# EAGLE design driver (EAGLE 6.5.0)
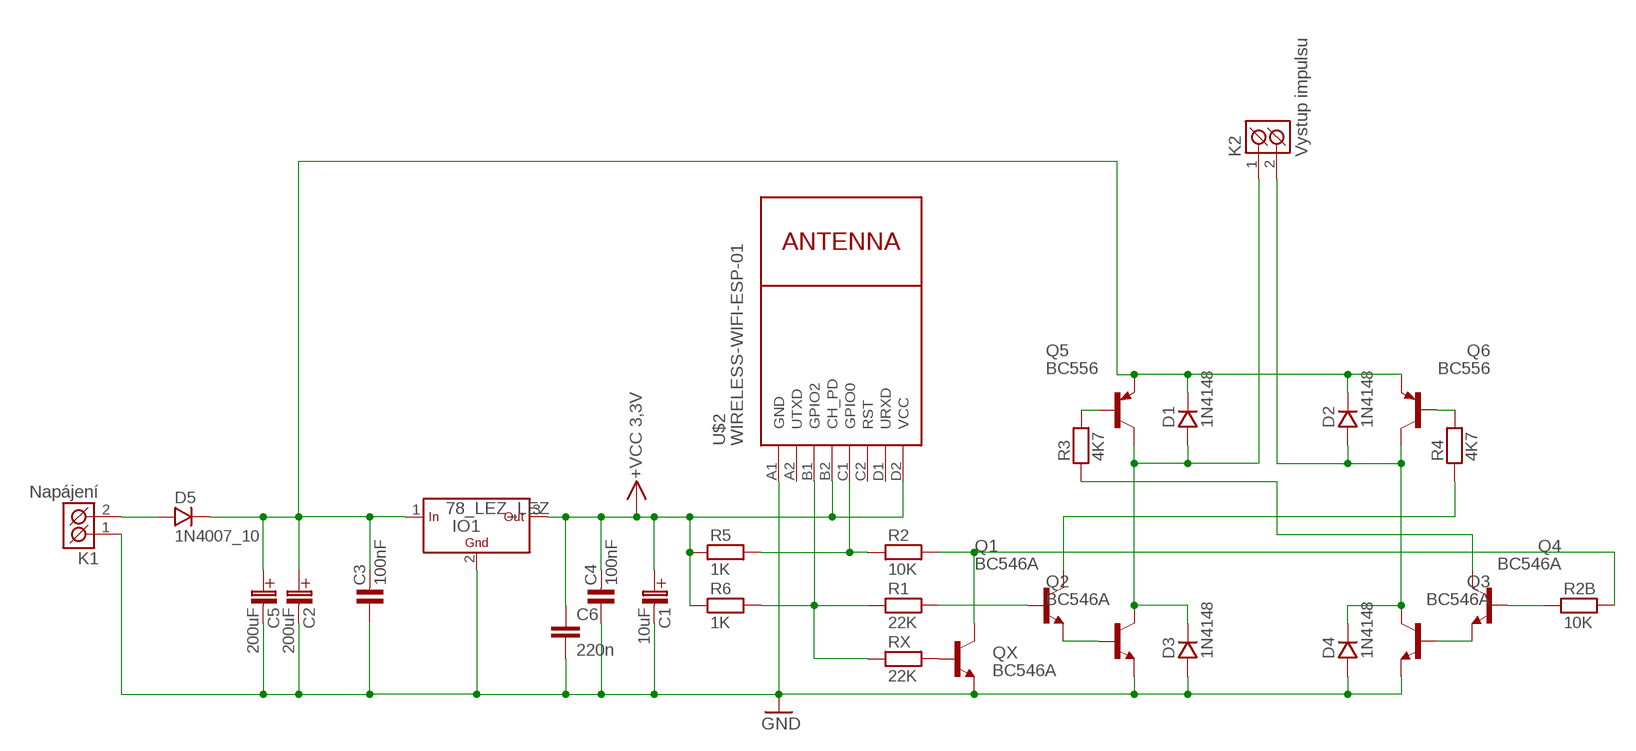
[diagram p0: schematic, sheet 1]

## Parts
C1  10uF  C-ELEKTROLYT_2,5  [C-EL_2,5]
C2  200uF  C-ELEKTROLYT_5  [C-EL_5]
C3  100nF  C-KERAMIK_5  [C-5]
C4  100nF  C-KERAMIK_5  [C-5]
C5  200uF  C-ELEKTROLYT_5  [C-EL_5]
C6  220n  C-EUC1206  [C1206]
D1  1N4148  1N4148_7,5  [DO35]
D2  1N4148  1N4148_7,5  [DO35]
D3  1N4148  1N4148_7,5  [DO35]
D4  1N4148  1N4148_7,5  [DO35]
D5  1N4007_10  [DO41]
IO1  78_LEZ_LEZ  [TO-220]
K1  Napájení  CZM_5/2  [CZM_5/2]
K2  Vystup impulsu  CZM_5/2  [CZM_5/2]
Q1  BC546A  [TO92-EBC]
Q2  BC546A  [TO92-EBC]
Q3  BC546A  [TO92-EBC]
Q4  BC546A  [TO92-EBC]
Q5  BC556  [TO92-EBC]
Q6  BC556  [TO92-EBC]
QX  BC546A  [TO92-EBC]
R1  22K  R_10  [R-10]
R2  10K  R_10  [R-10]
R2B  10K  R_10  [R-10]
R3  4K7  R_10  [R-10]
R4  4K7  R_10  [R-10]
R5  1K  R_10  [R-10]
R6  1K  R_10  [R-10]
RX  22K  R_10  [R-10]
U$2  WIRELESS-WIFI-ESP-01  [WIRELESS-WIFI-ESP-01]

## Nets
GND: C1.C-(C_EL-) C2.C-(C_EL-) C3.1 C4.1 C5.C-(C_EL-) C6.2 D3.A D4.A IO1.2(GND) K1.1(K1) Q2.E Q3.E QX.E U$2.A1(GND)
N$1: D2.A D4.K K2.2(K2) Q3.C Q6.C
N$2: D1.A D3.K K2.1(K1) Q2.C Q5.C
N$3: C2.C+(C_EL+) C3.2 C5.C+(C_EL+) D1.K D2.K D5.K IO1.1(IN) Q5.E Q6.E
N$4: Q5.B R3.2
N$5: Q6.B R4.2
N$6: Q4.C R3.1
N$7: Q1.C R4.1
N$8: Q4.B R2B.1
N$9: Q3.B Q4.E
N$10: Q1.E Q2.B
N$11: D5.A K1.2(K2)
N$12: Q1.B R1.2
N$13: R1.1 R6.2 RX.1 U$2.B1(GPIO2)
N$14: QX.C R2.2 R2B.2
N$15: R2.1 R5.2 U$2.C1(GPIO0)
N$16: QX.B RX.2
VCC: C1.C+(C_EL+) C4.2 C6.1 IO1.3(OUT) R5.1 R6.1 U$2.B2(CH_PD) U$2.D2(VCC) ; supply symbol labelled +VCC 3,3V
Unconnected: U$2.A2(UTXD) U$2.C2(RST) U$2.D1(URXD)

## Library data of the parts
C1 C2 C5 = #PaJa_21:C-ELEKTROLYT: Kondenzator - elektrolyticky
C3 C4 = #PaJa_21:C-KERAMIK: Kondenzator - keramicky
C6 = rcl:C-EU: CAPACITOR, European symbol
D1-D4 = #PaJa_21:1N4148: Univerzalni dioda - 0,15A, 75V
D5 = #PaJa_21:1N4007: Usmernovaci dioda - 1A, 1000V
IO1 = #PaJa_21:78??: Stabilizátor - 1A a 1,5A ?? - napeti => 05, 06, 08, 09, 12, 15, 18, 20, 24 => 1,5A ?? - napeti => 10, 12, 15, 18 => 1A S ?? - napeti => 05, 09, 10, 12, 15, 18, 24 => 2A T ?? - napeti => 05 => 3A
K1 K2 = #PaJa_21:CZM_5/2: Svorkovnice - roztec 5,08mm - dvojita 13,5A/250V
Q1-Q4 QX = transistor-npn:BC546*: NPN Transistor
Q5 Q6 = transistor-pnp:BC556*: PNP Transistror
R1 R2 R2B R3-R6 RX = #PaJa_21:R: Rezistor
U$2 = diy-modules:WIRELESS-WIFI-ESP-01: Wireless Wi-Fi ESP-01 Module based on ESP8266 chip Click here to find device on ebay.com <http://www.ebay.com/sch/esp8266+esp+01+transceiver>

## Board
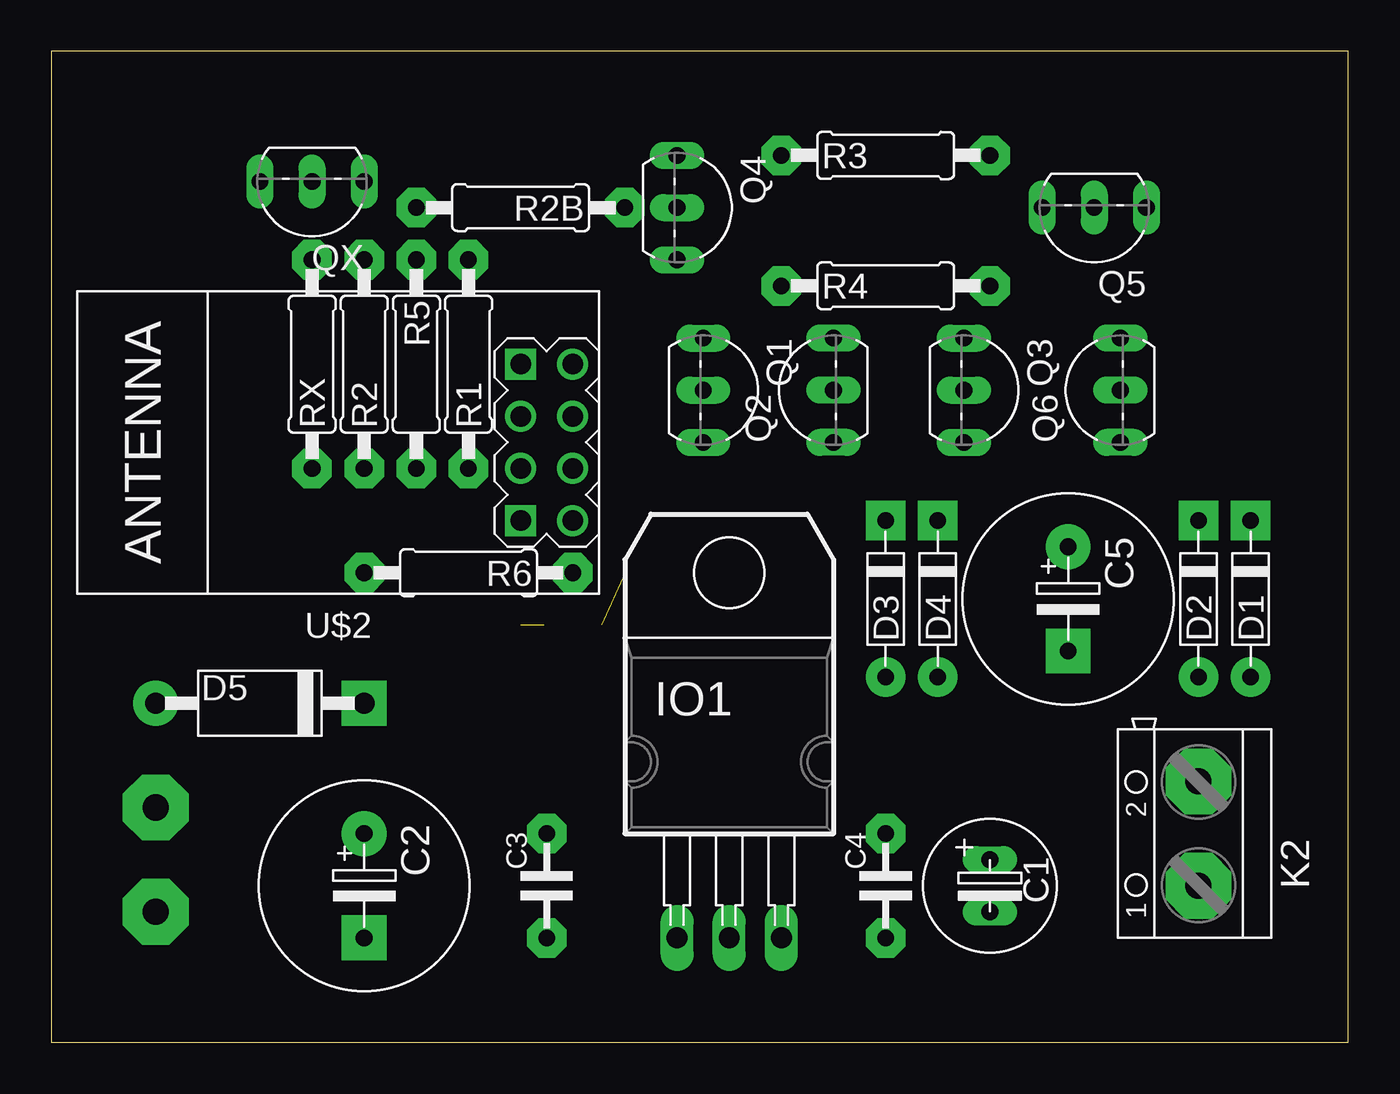
[diagram p1: board, top side]
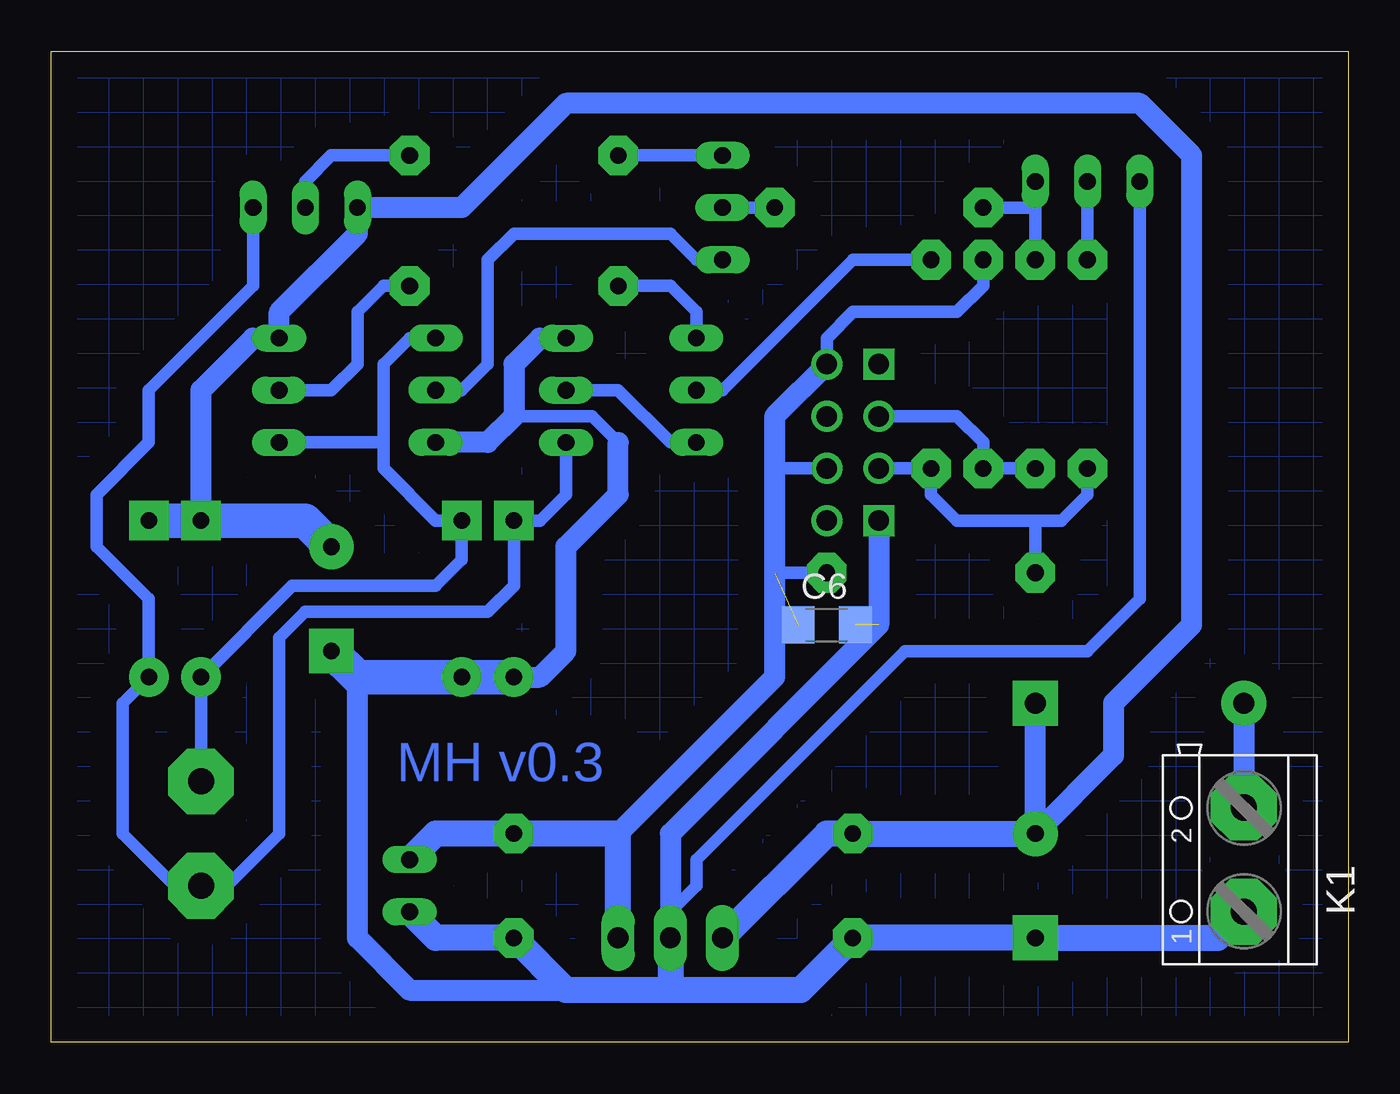
[diagram p2: board, bottom side, seen from below]

Size 63.17 x 48.25 mm. Coordinates in mm from the lower left corner, seen from the top.
Outline: 0,0 63.17,0 63.17,48.25 0,48.25 0,0
Copper layers (1*16): Top 0.035mm / dielectric 1.5mm / Bottom 0.035mm
Design rules "default": minimum track width 10mil, minimum drill 24mil, track to track 8mil, track to pad 8mil, pad to pad 8mil, via to via 8mil, smd to smd 8mil, copper to edge 40mil, drill to drill 8mil, minimum pad ring 10mil, minimum via ring 8mil, stop-mask expansion 4mil, vias tented up to drill 0mil, thermal gap 10mil

### Footprints (pad centres in the part's own frame; a part is rotated, then mirrored left to right if it is on the bottom)
C-EL_2,5 = drill 0.813 pad 1.27 long: C+ -1.27,0; C- 1.27,0
C-EL_5 = drill 0.813 pad 2.184: C+ -2.54,0 | drill 0.813 pad 2.184 square: C- 2.54,0
C-5 = drill 0.813 pad 1.93 octagon: 1 -2.54,0; 2 2.54,0
C1206 = smd 1.6 x 1.8: 1 -1.4,0; 2 1.4,0
DO35 = drill 0.813 pad 1.93: A -3.81,0 | drill 0.813 pad 1.93 square: K 3.81,0
DO41 = drill 1.016 pad 2.184: A -5.08,0 | drill 1.016 pad 2.184 square: K 5.08,0
TO-220 = drill 1.016 pad 1.6 long: 1 -2.54,0; 2 0,0; 3 2.54,0
CZM_5/2 = drill 1.27 pad 3.2 octagon: 1 -2.54,0; 2 2.54,0
TO92-EBC = drill 0.813 long: B 0,-1.27; C -2.54,-1.27; E 2.54,-1.27
R-10 = drill 0.813 pad 1.93 octagon: 1 -5.08,0; 2 5.08,0
WIRELESS-WIFI-ESP-01 = drill 1 square: A1 -8.89,3.81; D1 -8.89,-3.81 | drill 1: A2 -11.43,3.81; B1 -8.89,1.27; B2 -11.43,1.27; C1 -8.89,-1.27; C2 -11.43,-1.27; D2 -11.43,-3.81

### Placement (x,y rotation side)
C1  45.72,7.62 270 top
C2  15.24,7.62 270 top
C3  24.13,7.62 90 top
C4  40.64,7.62 90 top
C5  49.53,21.59 270 top
C6  25.4,20.32 0 bottom
D1  58.42,21.59 90 top
D2  55.88,21.59 90 top
D3  40.64,21.59 90 top
D4  43.18,21.59 90 top
D5  10.16,16.51 0 top
IO1  78_LEZ?  [TO-220]  33.02,5.08 0 top
K1  5.08,8.89 90 bottom
K2  55.88,10.16 90 top
Q1  33.02,31.75 270 top
Q2  36.83,31.75 90 top
Q3  45.72,31.75 270 top
Q4  31.75,40.64 270 top
Q5  50.8,39.37 180 top
Q6  50.8,31.75 90 top
QX  12.7,40.64 180 top
R1  20.32,33.02 90 top
R2  15.24,33.02 90 top
R2B  22.86,40.64 180 top
R3  40.64,43.18 0 top
R4  40.64,36.83 0 top
R5  17.78,33.02 270 top
R6  20.32,22.86 180 top
RX  12.7,33.02 90 top
U$2  13.97,29.21 180 top

### Tracks (layer width: path | path; a pad name or v marks a point on that pad's centre or on a via)
GND  (1 unrouted)
  Bottom 0.61: 40.64,30.48 36.83,30.48 35.56,29.21 | QX.E 10.16,21.59 12.7,19.05 21.59,19.05 31.75,8.89 31.75,7.62 33.02,6.35
  Bottom 1.016: Q2.E 39.37,34.29 40.64,33.02 40.64,30.48 41.91,29.21 Q3.E | 48.26,17.78 48.26,5.08 45.72,2.54 38.1,2.54 | D3.A 39.37,17.78 38.1,19.05 38.1,24.13 35.56,26.67 35.56,29.21 | U$2.A1 22.86,20.32 33.02,10.16 33.02,6.35 IO1.2
  Bottom 1.27: 33.02,2.54 26.67,2.54 C3.1 C2.C- 6.35,5.08 K1.1 | IO1.2 33.02,2.54 | 33.02,2.54 38.1,2.54 C4.1 44.45,5.08 C1.C-
  Bottom 1.676: D3.A D4.A 48.26,17.78 C5.C-
N$1
  Bottom 0.61: Q3.C 45.72,34.29 46.99,33.02 46.99,29.21 | Q6.C 46.99,29.21 | 46.99,29.21 46.99,27.94 44.45,25.4 D4.K 43.18,23.5 44.45,22.23 51.44,22.23 D2.A K2.2
N$2
  Bottom 0.61: Q2.C 38.1,26.67 39.37,25.4 D3.K 40.64,22.23 41.91,20.95 50.8,20.95 52.07,19.68 52.07,10.16 54.61,7.62 K2.1 57.15,7.62 59.69,10.16 59.69,16.51 D1.A 58.42,21.59 60.96,24.13 60.96,26.67 58.42,29.21 58.42,31.75 53.34,36.83 Q5.C
N$3
  Bottom 1.016: D5.K C2.C+ 11.43,13.97 11.43,16.51 7.62,20.32 7.62,43.18 10.16,45.72 38.1,45.72 43.18,40.64 Q5.E 48.26,39.37 52.07,35.56 Q6.E 53.34,34.29 55.88,31.75 D2.K
  Bottom 1.27: IO1.1 25.4,10.16 C3.2 C2.C+
  Bottom 1.676: D1.K D2.K 50.8,25.4 C5.C+
N$4
  Bottom 0.61: Q5.B 50.8,41.91 49.53,43.18 R3.2
N$5
  Bottom 0.61: R4.2 46.99,36.83 48.26,35.56 48.26,33.02 49.53,31.75 Q6.B
N$6
  Bottom 0.61: Q4.C R3.1
N$7
  Bottom 0.61: Q1.C 31.75,35.56 33.02,36.83 R4.1
N$8
  Bottom 0.61: Q4.B R2B.1
N$9
  Bottom 0.61: Q4.E 31.75,38.1 33.02,39.37 40.64,39.37 41.91,38.1 41.91,33.02 43.18,31.75 Q3.B
N$10
  Bottom 0.61: Q2.B 35.56,31.75 33.02,29.21 Q1.E
N$11
  Bottom 0.406: 5.08,10.16 K1.2
  Bottom 1.016: D5.A K1.2
N$12
  Bottom 0.61: Q1.B 30.48,31.75 24.13,38.1 R1.2
N$13
  Bottom 0.61: RX.1 12.7,26.67 13.97,25.4 15.24,25.4 | 15.24,25.4 19.05,25.4 20.32,26.67 R1.1 U$2.B1 | R6.2 15.24,25.4
N$14
  Bottom 0.61: R2.2 15.24,40.64 | 15.24,40.64 QX.C | R2B.2 15.24,40.64
N$15
  Bottom 0.61: R2.1 R5.2 17.78,29.21 19.05,30.48 U$2.C1
N$16
  Bottom 0.61: QX.B RX.2
VCC  (1 unrouted)
  Bottom 0.61: R6.1 27.94,22.86 | U$2.B2 27.94,27.94 | U$2.D2 25.4,34.29 24.13,35.56 19.05,35.56 17.78,36.83 R5.1
  Bottom 1.016: U$2.D2 27.94,30.48 27.94,27.94 27.94,22.86 27.94,17.78 35.56,10.16
  Bottom 1.27: C1.C+ 44.45,10.16 C4.2 35.56,10.16 IO1.3
VYPLN
  pour Bottom (isolate 1.27, hatched): 0,48.26 0,0 63.5,0 63.5,48.26

### Text on the board
Bottom: MH v0.3